# Altium schematic sheet FPGA_HexMultiplier.SchDoc: LiveDesign Evaluation - Multiplier
size A; Organization: Altium Limited; Address1: L3, 12a Rodborough Rd; Address2: Frenchs Forest; Address3: NSW; Address4: Australia 2086; DocumentNumber: 1; SheetNumber: 1; SheetTotal: 1
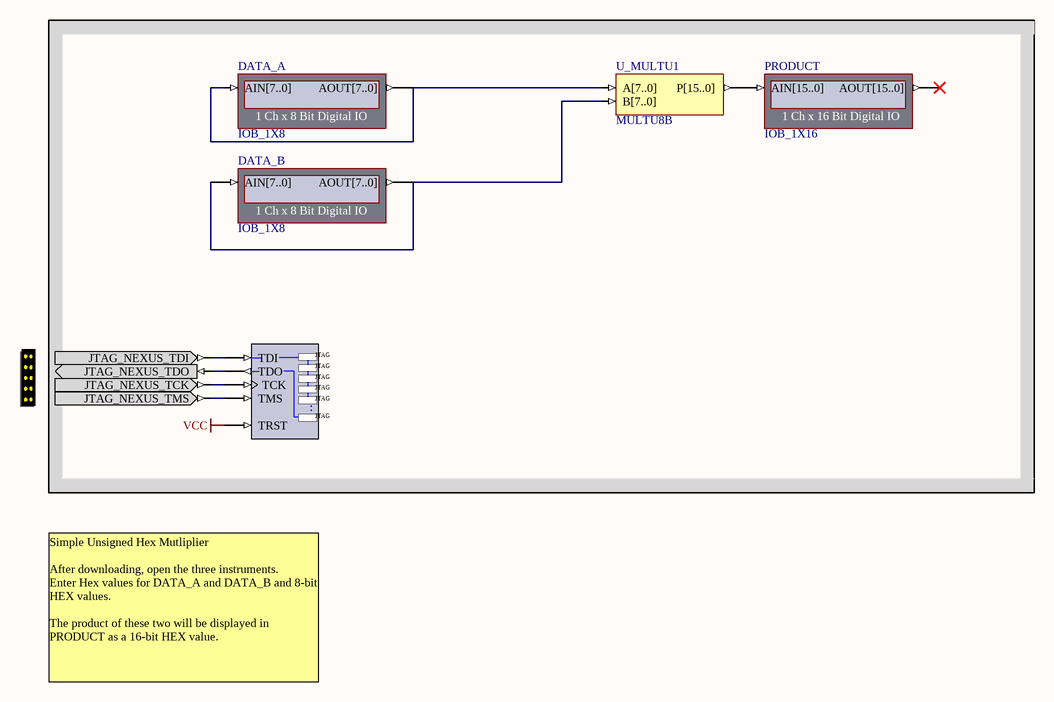
[diagram p0: FPGA_HexMultiplier.SchDoc]

## Parts
DATA_A  IOB_1X8
DATA_B  IOB_1X8
NEXUS_JTAG_CONNECTOR  NEXUS_JTAG_CONNECTOR  (value not drawn)
NEXUS_JTAG_PORT  NEXUS_JTAG_PORT  (value not drawn)
PRODUCT  IOB_1X16
U_MULTU1  MULTU8B

## Nets
VCC: NEXUS_JTAG_PORT.TRST
NetDATA_A_AIN[7..0]: DATA_A.AIN[7..0] DATA_A.AOUT[7..0] U_MULTU1.A[7..0]
NetDATA_B_AIN[7..0]: DATA_B.AIN[7..0] DATA_B.AOUT[7..0] U_MULTU1.B[7..0]
NetNEXUS_JTAG_CONNECTOR_JTAG_NEXUS_TCK: NEXUS_JTAG_CONNECTOR.JTAG_NEXUS_TCK NEXUS_JTAG_PORT.TCK
NetNEXUS_JTAG_CONNECTOR_JTAG_NEXUS_TDI: NEXUS_JTAG_CONNECTOR.JTAG_NEXUS_TDI NEXUS_JTAG_PORT.TDI
NetNEXUS_JTAG_CONNECTOR_JTAG_NEXUS_TDO: NEXUS_JTAG_CONNECTOR.JTAG_NEXUS_TDO NEXUS_JTAG_PORT.TDO
NetNEXUS_JTAG_CONNECTOR_JTAG_NEXUS_TMS: NEXUS_JTAG_CONNECTOR.JTAG_NEXUS_TMS NEXUS_JTAG_PORT.TMS
NetPRODUCT_AIN[15..0]: PRODUCT.AIN[15..0] U_MULTU1.P[15..0]

Not connected (* = marked no-connect by the designer): PRODUCT AOUT[15..0]*

## Notes on the sheet
- Simple Unsigned Hex Mutliplier
  After downloading, open the three instruments.
  Enter Hex values for DATA_A and DATA_B and 8-bit HEX values.
  The product of these two will be displayed in PRODUCT as a 16-bit HEX value.
- Title
- Size:
- Date:
- A
- Number:
- Time:
- Revision:
- Sheet
- of
- File:
- (in symbol NEXUS_JTAG_PORT) JTAG; .

## Library data of the parts
DATA_A DATA_B = IOB_1X8: 1 Ch x 8 Bit Digital IO; NEXUS_CORE: Instrument; NEXUS_JTAG_DEVICE: True; NEXUS_JTAG_ORDER: 0; Published: 30/09/2003; Publisher: Altium Hobart Technology Centre; Core Revision: 1.00.00
NEXUS_JTAG_CONNECTOR = NEXUS_JTAG_CONNECTOR: JTAG Port; PortComponent: True; Published: 19-Nov-2003; Publisher: Altium Limited
NEXUS_JTAG_PORT = NEXUS_JTAG_PORT: Soft Nexus-Chain Connector; NEXUS_JTAG_CONNECTOR: True; Published: 18-Dec-2003; Publisher: Altium Limited
PRODUCT = IOB_1X16: 1 Ch x 16 Bit Digital IO; NEXUS_CORE: Instrument; NEXUS_JTAG_DEVICE: True; NEXUS_JTAG_ORDER: 0; Published: 30/09/2003; Publisher: Altium Hobart Technology Centre; Core Revision: 1.00.00
U_MULTU1 = MULTU8B: 8x8 Unsigned Multiplier, Bus Version; ArchiveName: GENERIC; Published: 18-Dec-2003; Publisher: Altium Limited; Core Revision: 1.00.00